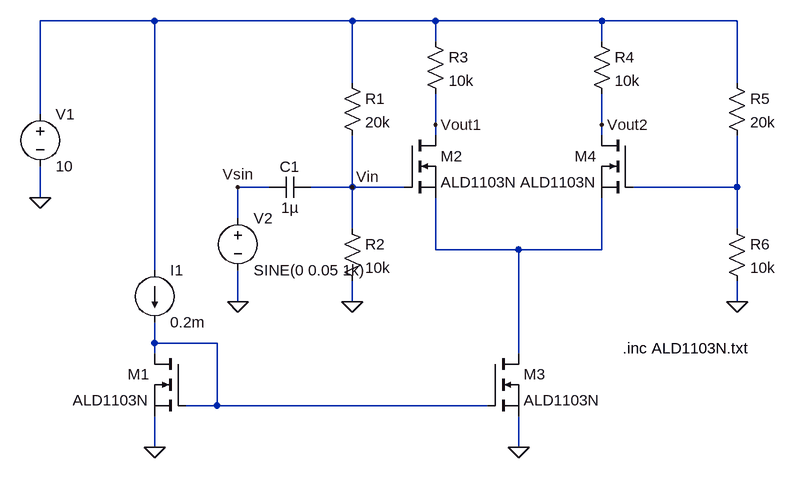
[diagram p0: schematic exp1.asc]
exp1.asc, the LTspice schematic file:
Version 4.1
SHEET 1 1076 680
WIRE 112 -208 -64 -208
WIRE 416 -208 112 -208
WIRE 544 -208 416 -208
WIRE 800 -208 544 -208
WIRE 1008 -208 800 -208
WIRE 544 -176 544 -208
WIRE 800 -176 800 -208
WIRE 416 -112 416 -208
WIRE 1008 -112 1008 -208
WIRE -64 -64 -64 -208
WIRE 544 -48 544 -96
WIRE 800 -48 800 -96
WIRE 544 -32 544 -48
WIRE 800 -32 800 -48
WIRE 288 48 240 48
WIRE 416 48 416 -32
WIRE 416 48 352 48
WIRE 496 48 416 48
WIRE 1008 48 1008 -32
WIRE 1008 48 848 48
WIRE -64 64 -64 16
WIRE 240 96 240 48
WIRE 416 112 416 48
WIRE 1008 112 1008 48
WIRE 544 144 544 64
WIRE 672 144 544 144
WIRE 800 144 800 64
WIRE 800 144 672 144
WIRE 112 176 112 -208
WIRE 240 224 240 176
WIRE 416 224 416 192
WIRE 1008 224 1008 192
WIRE 112 288 112 256
WIRE 208 288 112 288
WIRE 112 304 112 288
WIRE 672 304 672 144
WIRE 208 384 208 288
WIRE 208 384 160 384
WIRE 624 384 208 384
WIRE 112 448 112 400
WIRE 672 448 672 400
FLAG 1008 224 0
FLAG 416 224 0
FLAG 112 448 0
FLAG -64 64 0
FLAG 240 224 0
FLAG 672 448 0
FLAG 416 48 Vin
FLAG 240 48 Vsin
FLAG 544 -48 Vout1
FLAG 800 -48 Vout2
SYMBOL voltage -64 -80 R0
WINDOW 123 0 0 Left 0
WINDOW 39 0 0 Left 0
SYMATTR InstName V1
SYMATTR Value 10
SYMBOL current 112 176 R0
WINDOW 123 0 0 Left 0
WINDOW 39 0 0 Left 0
SYMATTR InstName I1
SYMATTR Value 0.2m
SYMBOL nmos 160 304 M0
SYMATTR InstName M1
SYMATTR Value ALD1103N
SYMBOL nmos 496 -32 R0
SYMATTR InstName M2
SYMATTR Value ALD1103N
SYMBOL nmos 624 304 R0
SYMATTR InstName M3
SYMATTR Value ALD1103N
SYMBOL nmos 848 -32 M0
SYMATTR InstName M4
SYMATTR Value ALD1103N
SYMBOL voltage 240 80 R0
WINDOW 123 0 0 Left 0
WINDOW 39 0 0 Left 0
SYMATTR InstName V2
SYMATTR Value SINE(0 0.05 1k)
SYMBOL cap 352 32 R90
WINDOW 0 0 32 VBottom 2
WINDOW 3 32 32 VTop 2
SYMATTR InstName C1
SYMATTR Value 1µ
SYMBOL res 400 -128 R0
SYMATTR InstName R1
SYMATTR Value 20k
SYMBOL res 400 96 R0
SYMATTR InstName R2
SYMATTR Value 10k
SYMBOL res 528 -192 R0
SYMATTR InstName R3
SYMATTR Value 10k
SYMBOL res 784 -192 R0
SYMATTR InstName R4
SYMATTR Value 10k
SYMBOL res 992 -128 R0
SYMATTR InstName R5
SYMATTR Value 20k
SYMBOL res 992 96 R0
SYMATTR InstName R6
SYMATTR Value 10k
TEXT 832 296 Left 2 !.inc ALD1103N.txt

The netlist it stands for:
* exp1.asc
V1 N001 0 10
I1 N001 N004 0.2m
M1 N004 N004 0 0 ALD1103N
M2 Vout1 Vin N003 N003 ALD1103N
M3 N003 N004 0 0 ALD1103N
M4 Vout2 N002 N003 N003 ALD1103N
V2 Vsin 0 SINE(0 0.05 1k)
C1 Vin Vsin 1µ
R1 N001 Vin 20k
R2 Vin 0 10k
R3 N001 Vout1 10k
R4 N001 Vout2 10k
R5 N001 N002 20k
R6 N002 0 10k
.model NMOS NMOS
.model PMOS PMOS
.lib standard.mos
.inc ALD1103N.txt
.backanno
.end